# Altium schematic sheet LED Matrix connector.SchDoc
size A4
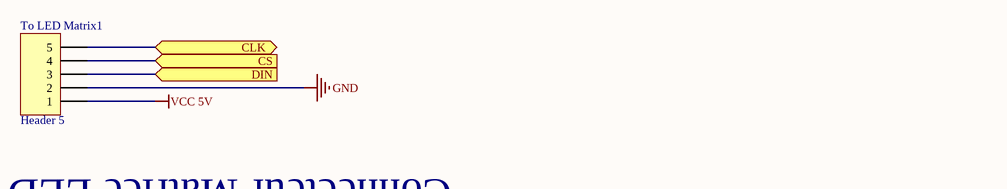
[diagram p0: LED Matrix connector.SchDoc]

## Parts
To_LED_Matrix1  Header 5  [HDR1X5]

## Ports
CLK (bidir), CS (in), DIN (in)

## Nets
GND: To_LED_Matrix1.2
VCC 5V: To_LED_Matrix1.1
CLK: To_LED_Matrix1.5 ; port CLK
CS: To_LED_Matrix1.4 ; port CS
DIN: To_LED_Matrix1.3 ; port DIN

## Notes on the sheet
- Connecteur Matrice LED

## Library data of the parts
To_LED_Matrix1 = Header 5: Header, 5-Pin; LatestRevisionDate: 17-Jul-2002; LatestRevisionNote: Re-released for DXP Platform.; Publisher: Altium Limited